# EAGLE design OpenROV Light Board 2.8A (EAGLE 6.4)
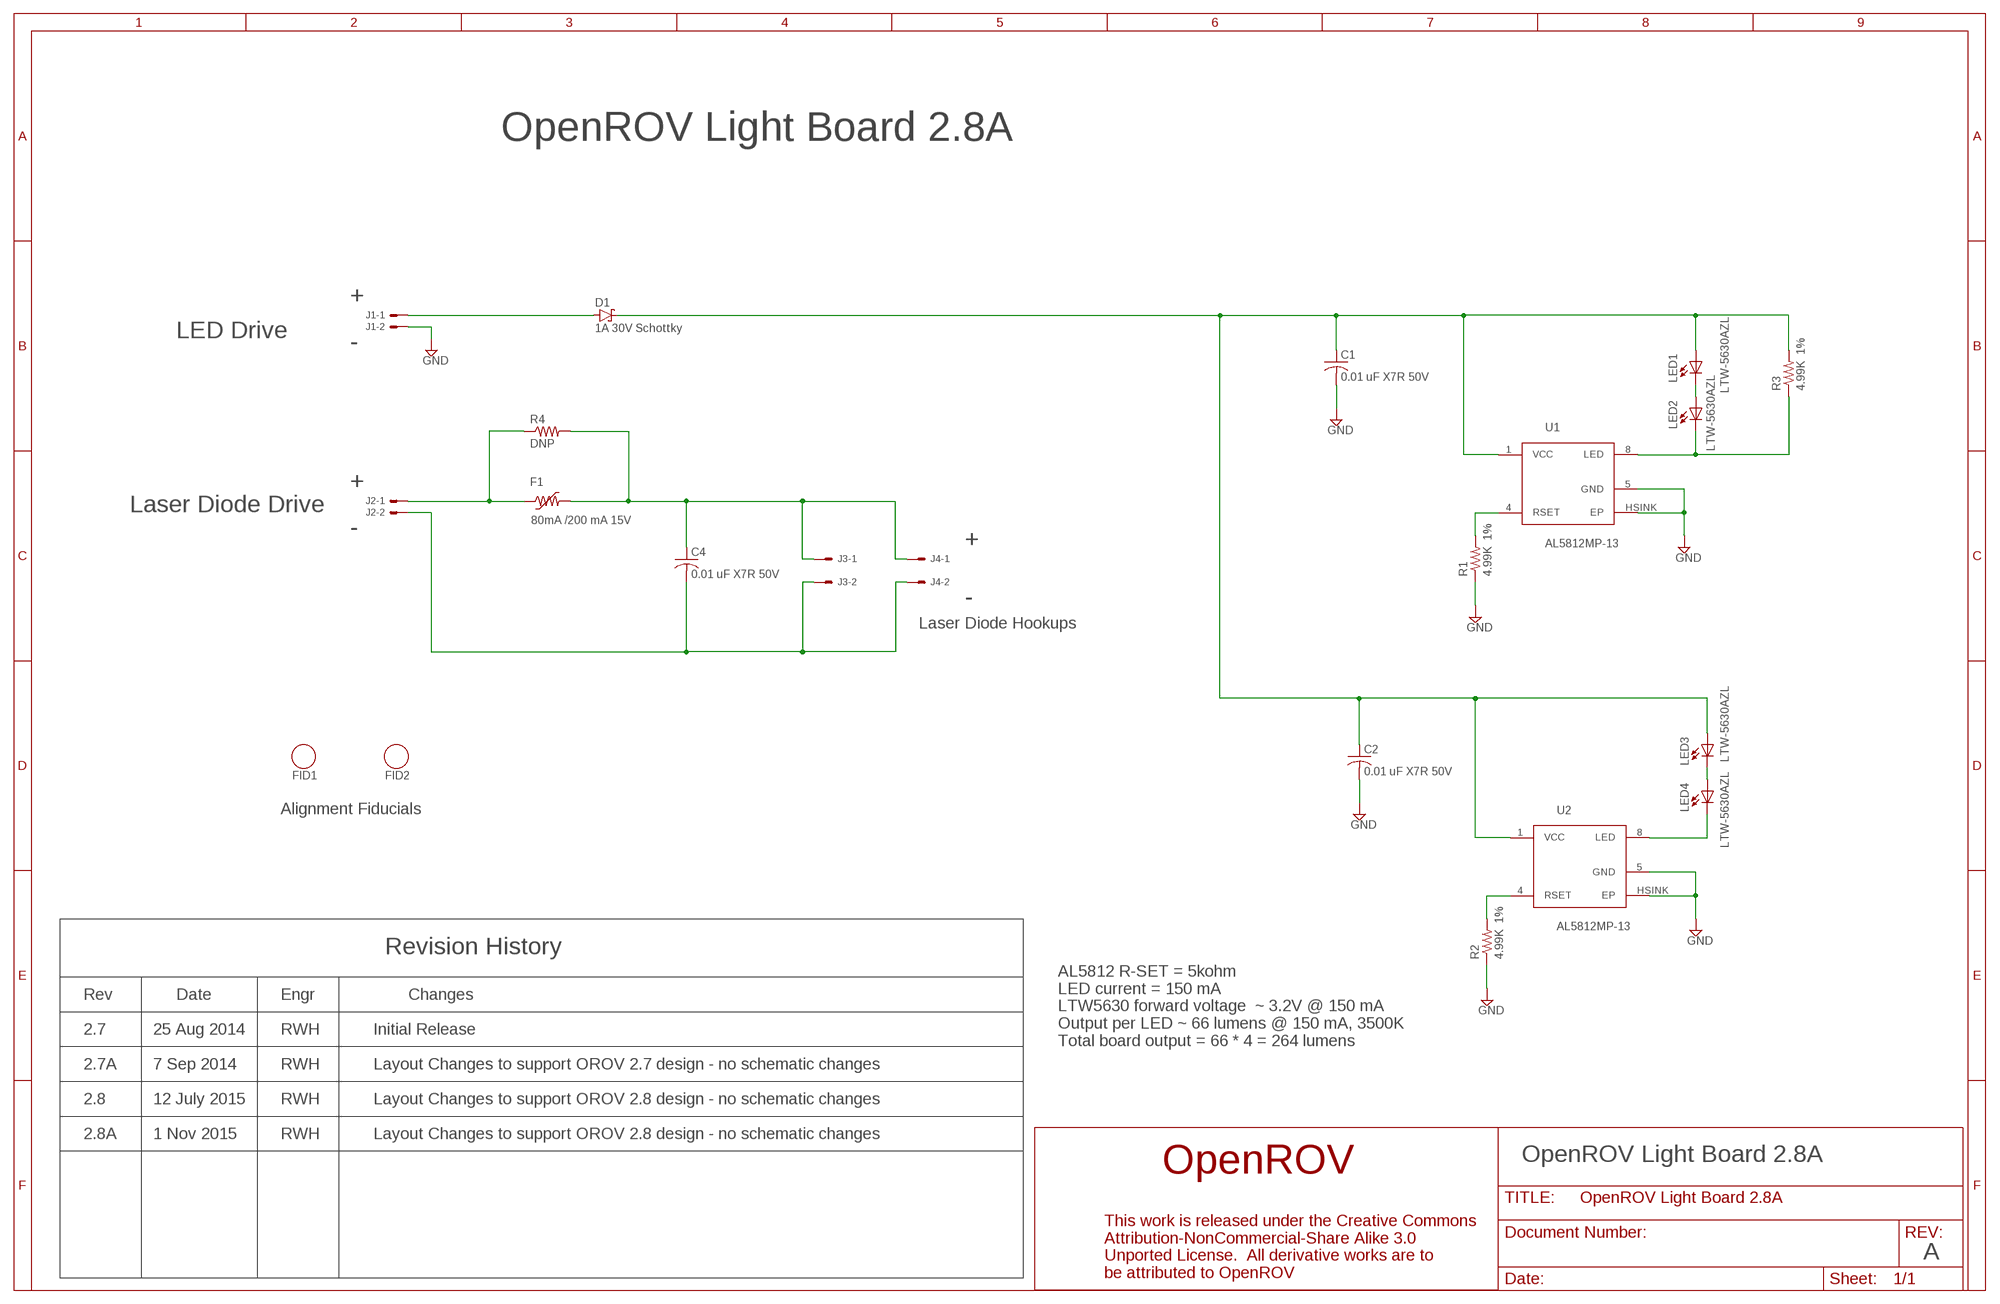
[diagram p0: schematic, sheet 1]

## Parts
C1  0.01 uF X7R 50V  CAP0603  [R0603]
C2  0.01 uF X7R 50V  CAP0603  [R0603]
C4  0.01 uF X7R 50V  CAP0603  [R0603]
D1  1A 30V Schottky  SCHOTTKYDO214AC  [DO214AC]
F1  80mA /200 mA 15V  POLYFUSE-0603  [R0603]
FID1  FIDUCIAL_1  [FIDUCIAL_1]
FID2  FIDUCIAL_1  [FIDUCIAL_1]
J1  SOLDER_PADS_3MM  [SOLDER_PADS_3MM]
J2  SOLDER_PADS_3MM  [SOLDER_PADS_3MM]
J3  SOLDER_PADS_3MM-SMALL_HOLE  [SOLDER_PADS_3MM_SMALL_HOLE]
J4  SOLDER_PADS_3MM-SMALL_HOLE  [SOLDER_PADS_3MM_SMALL_HOLE]
LED1  LTW-5630AZL  [LITEON-5630]
LED2  LTW-5630AZL  [LITEON-5630]
LED3  LTW-5630AZL  [LITEON-5630]
LED4  LTW-5630AZL  [LITEON-5630]
R1  4.99K 1%  RESISTOR-0603  [R0603]
R2  4.99K 1%  RESISTOR-0603  [R0603]
R3  4.99K 1%  RESISTOR-0603  [R0603]
R4  DNP  RESISTOR-1206  [R1206]
U1  AL5812MP-13  [MSOP-8EP]
U2  AL5812MP-13  [MSOP-8EP]

## Nets
GND: C1.2 C2.2 J1.2 R1.1 R2.1 U1.5(GND) U1.HSINK(EP) U2.5(GND) U2.HSINK(EP)
N$1: LED2.C1(C) LED2.C2(C) R3.1 U1.8(LED)
N$2: LED1.C1(C) LED1.C2(C) LED2.A1(A) LED2.A2(A) LED2.A3(A)
N$3: C4.1 F1.2 J3.1 J4.1 R4.2
N$4: C4.2 J2.2 J3.2 J4.2
N$5: F1.1 J2.1 R4.1
N$6: R1.2 U1.4(RSET)
N$7: LED4.C1(C) LED4.C2(C) U2.8(LED)
N$8: LED3.C1(C) LED3.C2(C) LED4.A1(A) LED4.A2(A) LED4.A3(A)
N$9: C1.1 C2.1 D1.C LED1.A1(A) LED1.A2(A) LED1.A3(A) LED3.A1(A) LED3.A2(A) LED3.A3(A) R3.2 U1.1(VCC) U2.1(VCC)
N$11: D1.A J1.1
N$13: R2.2 U2.4(RSET)

## Notes on the sheet
- OpenROV Light Board 2.8A
- +
- LED Drive
- -
- +
- Laser Diode Drive
- -
- +
- -
- Laser Diode Hookups
- Alignment Fiducials
- Revision History
- Rev | Date | Engr | Changes
- 2.7 | 25 Aug 2014 | RWH | Initial Release
- AL5812 R-SET = 5kohm
  LED current = 150 mA
  LTW5630 forward voltage  ~ 3.2V @ 150 mA
  Output per LED ~ 66 lumens @ 150 mA, 3500K
  Total board output = 66 * 4 = 264 lumens
- 2.7A | 7 Sep 2014 | RWH | Layout Changes to support OROV 2.7 design - no schematic changes
- 2.8 | 12 July 2015 | RWH | Layout Changes to support OROV 2.8 design - no schematic changes
- 2.8A | 1 Nov 2015 | RWH | Layout Changes to support OROV 2.8 design - no schematic changes
- OpenROV Light Board 2.8A
- A

## Library data of the parts
C1 C2 C4 = Walts_Generic_Parts:CAP: Generic Non-Polarized Capacitor
D1 = Walts_Generic_Parts:SCHOTTKY: Silicon Schottky Diodes
F1 = Walts_Generic_Parts:POLYFUSE: Polyfuse / PPTC
FID1 FID2 = Walts Test Points and Pads:FIDUCIAL_1: Alignment Fiducial
J1-J4 = OpenROV General Library:SOLDER_PADS_3MM: Custom 3mm solder pads for OROV light board
LED1-LED4 = OpenROV LED Library:LTW-5630AZL: Lite-On 5x3 mm LTW-5630AZL White LED
R1-R4 = Walts_Generic_Parts:RESISTOR: Generic Resistor
U1 U2 = OpenROV LED Library:AL5812: Diodes, Inc AL5812 LED Driver

## Board
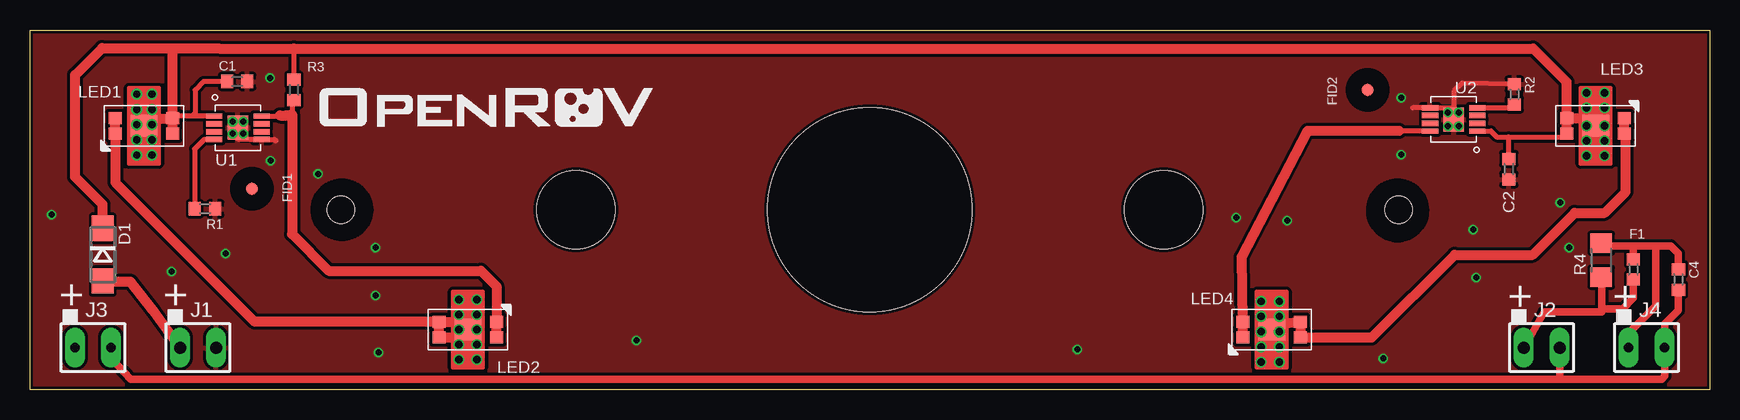
[diagram p1: board, top side]
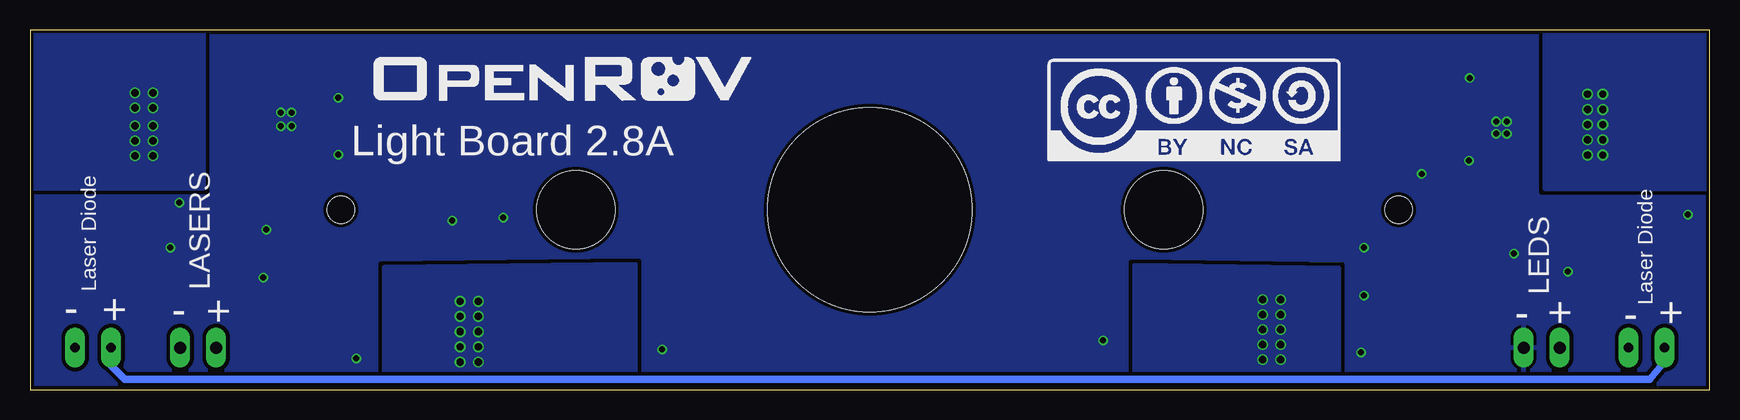
[diagram p2: board, bottom side, seen from below]

Size 140 x 30 mm. Coordinates in mm from the lower left corner, seen from the top.
Outline: 0,0 0,30 140,30 140,0 0,0
Copper layers (1*2*15*16): Top 0.035mm / dielectric 0.2mm / Route2 0.0175mm / dielectric 1.1mm / Route15 0.0175mm / dielectric 0.2mm / Bottom 0.035mm
Design rules "SeeedStudio_DRU_no_angle_20130527": minimum track width 6mil, minimum drill 12mil, track to track 6mil, track to pad 6mil, pad to pad 6mil, via to via 6mil, smd to smd 0mil, copper to edge 10mil, drill to drill 10mil, minimum pad ring 6mil, minimum via ring 6mil, stop-mask expansion 2mil, vias tented up to drill 25mil, thermal gap 10mil
Holes 17 mm at 70,15
Holes 6.5 mm at 45.5,15 94.5,15
Holes 2.25 mm at 25.91,15 114.09,15

### Footprints (pad centres in the part's own frame; a part is rotated, then mirrored left to right if it is on the bottom)
R0603 = smd 1 x 1.1: 1 -0.85,0; 2 0.85,0
DO214AC = smd 2.1 x 1.8: A 2.2,0; C -2.2,0
FIDUCIAL_1 = smd 1.016 x 1.016: P$1 0,0
SOLDER_PADS_3MM = drill 1 pad 1.676 long: 1 -1.5,0; 2 1.5,0
SOLDER_PADS_3MM_SMALL_HOLE = drill 0.8 pad 1.676 long: 1 -1.5,0; 2 1.5,0
LITEON-5630 = smd 1.1 x 1: A1 2.4,-0.65; A2 2.4,0.65; C1 -2.4,-0.65; C2 -2.4,0.65 | smd 2.2 x 1.8: A3 0,0
R1206 = smd 1.6 x 1.803: 1 -1.422,0; 2 1.422,0
MSOP-8EP = smd 0.45 x 1.35: 1 -0.975,-1.975; 2 -0.325,-1.975; 3 0.325,-1.975; 4 0.975,-1.975; 5 0.975,1.975; 6 0.325,1.975; 7 -0.325,1.975; 8 -0.975,1.975 | smd 2 x 1.7: HSINK 0,0

### Placement (x,y rotation side)
C1  17.27,25.71 0 top
C2  123.27,18.39 270 top
C4  137.41,9.18 270 top
D1  6.06,11.25 270 top
F1  133.66,10.02 90 top
FID1  18.5,16.75 180 top
FID2  111.5,25 0 top
J1  14,3.5 0 top
J2  126,3.5 0 top
J3  5.25,3.5 0 top
J4  134.75,3.5 0 top
LED1  9.5,22 0 top
LED2  36.5,5 180 top
LED3  130.5,22 180 top
LED4  103.5,5 0 top
R1  14.59,15.08 180 top
R2  123.73,24.62 270 top
R3  22,25 90 top
R4  130.97,10.79 90 top
U1  17.33,21.84 270 top
U2  118.68,22.54 90 top
U$1  [CC-LOGO-1-TOP]  55.16,19.07 0 bottom
U$2  [OROV-LOGO-1.25]  112.18,22.65 0 bottom
U$4  [OROV-LOGO-1.10]  23,20 0 top

### Tracks (layer width: path | path; a pad name or v marks a point on that pad's centre or on a via)
GND  (via drill 0.5)
  Top 0.406: 19.31,20.86 U1.5 | U1.HSINK 17.33,21.92 v16.9,22.35 | U1.5 17.37,20.86 v16.9,21.34 | v118.2,23.11 118.2,23.02 U2.HSINK | 118.69,23.51 U2.5 115.26,23.51 115.25,23.5 | 118.69,23.51 v119.09,23.11 | R2.1 119.39,25.57 118.71,24.89 118.71,23.53 118.69,23.51 | U1.5 20.39,20.86 20.5,20.75
  other vias: 17.79,22.35 17.79,21.34 119.09,21.97 118.2,21.97 114.3,19.59 20,26 112.8,2.58 120.55,9.34 127.55,15.59 87.3,3.33 50.55,4.08 29.05,3.08 100.55,14.34 28.8,11.84 28.8,7.83 1.8,14.59 114.3,24.34 128.3,11.84 120.3,13.34 104.8,14.09 16.3,11.34 11.8,9.84 20.05,19.09 24,18
  pour Bottom (isolate 0.305, rank 2): -0.5,0 -0.5,30 140.5,30 140.5,0
  pour Top (isolate 0.254, rank 2): -0.5,0 -0.5,30 140.5,30 140.5,0
N$1
  Top 0.406: U1.8 20.79,22.82 20.84,22.86 | R3.1 21.85,24.42 21.85,22.98
  Top 0.813: 20.84,22.86 21.34,22.86 21.85,22.98 21.85,12.97 24.92,9.91 37.59,9.91 38.88,8.62 38.88,5.67 LED2.C1 LED2.C2
N$2  (via drill 0.6)
  Top 0.406: v35.75,6.25 35.75,5.75 36.12,5.38
  Top 0.813: LED1.C2 LED1.C1 7.12,21.33 7.12,17.27 18.74,5.65 LED2.A1 | LED2.A1 LED2.A2 36.4,4.35 36.5,4.25 | LED2.A1 35.85,5.65 36.12,5.38 LED2.A3
  other vias: 35.75,7.5 37.25,7.5 37.25,5 35.75,5 37.25,6.25 37.25,3.75 37.25,2.5 35.75,2.5 35.75,3.75
  pour Bottom (isolate 0.305): 30.82,10.18 48.01,10.43 48.01,0.76 30.82,0.51
N$3
  Top 0.61: 133.5,12 131.18,12 R4.2 | F1.2 133.66,11.84 133.5,12 | 133.5,12 135.5,12 | 135.5,12 136.75,12 137.38,11.38 137.38,10.07 C4.1 | 135.5,12 135.5,7 133.25,4.75 J4.1
  Bottom 0.61: J3.1 3.75,2.38 5,0.88 132.12,0.88 133.25,2 J4.1
N$4
  Top 0.61: J2.2 127.52,1.52 127.5,0.88 | 127.5,0.88 8.38,0.88 6.75,2.62 J3.2 | 127.5,0.88 136,0.88 136.27,1.15 136.27,3.48 J4.2 136.25,5.5 137.38,6.62 137.38,8.29 C4.2
N$5
  Top 0.61: J2.1 126.23,6.48 131,6.5 131,6.75 | 131,6.75 131,9.33 R4.1 | F1.1 133.66,7.66 132.75,6.75 131,6.75
N$6
  Top 0.406: U1.4 14.52,20.86 13.72,20.07 13.72,15.17 R1.2
N$7
  Top 0.406: 114.13,21.59 116.68,21.59 U2.8
  Top 0.813: LED4.C1 LED4.C2 101,11.08 106.51,21.59 114.13,21.59
N$8  (via drill 0.6)
  Top 0.406: v104.15,4.83 103.82,5.16
  Top 0.813: LED4.A3 103.82,5.16 104.05,5.4 LED4.A2 LED4.A1 111.85,4.35 118.75,11.25 125.25,11.25 128.75,14.75 131.25,14.75 133,16.5 133,21.25 LED3.C2 LED3.C1
  other vias: 102.62,4.83 102.62,6.1 104.15,6.1 102.62,7.37 102.62,3.56 102.62,2.29 104.15,2.29 104.15,3.56 104.15,7.37
  pour Bottom (isolate 0.305): 89.52,10.43 110.5,10.18 110.5,-0.25 89.52,0
N$9  (via drill 0.6)
  Top 0.406: U1.1 13.5,22.82 | 13.5,22.82 12.06,22.82 LED1.A2 | U2.1 121.78,21.56 122.26,21.08 123.25,21.08 | v10.17,22.1 9.6,22.1 LED1.A3 | 23,28.43 23.25,28.44 | v129.75,22 LED3.A3 | C1.1 14.46,25.71 13.75,25 13.75,23.07 13.5,22.82 | 123.25,21.08 127.83,21.08 LED3.A2 | C2.1 123.27,21.06 123.25,21.08 | R3.2 22,26.12 22,28.44
  Top 0.813: LED1.A1 LED1.A2 | LED1.A3 9.82,22 10.42,22.61 11.86,22.61 LED1.A2 | 128,21.25 LED3.A2 LED3.A1 | LED3.A1 128.1,25.66 125.31,28.45 23.25,28.44 22,28.44 15.76,28.45 12,28.45 | LED3.A1 129.85,22.65 LED3.A3 | D1.C 6.06,15.44 3.75,17.75 3.75,26.25 6,28.5 6.05,28.45 12,28.45 | LED1.A2 11.9,28.35 12,28.45
  other vias: 8.9,22.1 8.9,23.37 10.17,23.37 10.17,24.64 8.9,24.64 8.9,20.83 10.17,20.83 10.17,19.56 8.9,19.56 129.75,24.75 131.25,24.75 131.25,22 131.25,23.5 129.75,23.5 131.25,20.75 131.25,19.5 129.75,20.75 129.75,19.5
  pour Bottom: 13.72,29.97 13.72,16.76 -0.25,16.76 -0.25,29.97
  pour Bottom: 125.56,29.72 125.56,16.76 140.3,16.76 140.3,29.72
N$10
  cutout Top: 23.5,15 arc-90 26,17.5 arc-90 28.5,15 arc-90 26,12.5 arc-90
N$11
  Top 0.813: J1.1 10.23,6.64 8.38,9 6.12,8.99 D1.A
N$12
  cutout Top: 111.5,15 arc-90 114,17.5 arc-90 116.5,15 arc-90 114,12.38 arc-90
N$13
  Top 0.406: U2.4 124.03,23.51 R2.2

### Text on the board
tPlace: + | + | + | +
bPlace: Light Board 2.8A | LEDS | LASERS | Laser Diode | Laser Diode | - | + | - | + | - | + | - | +